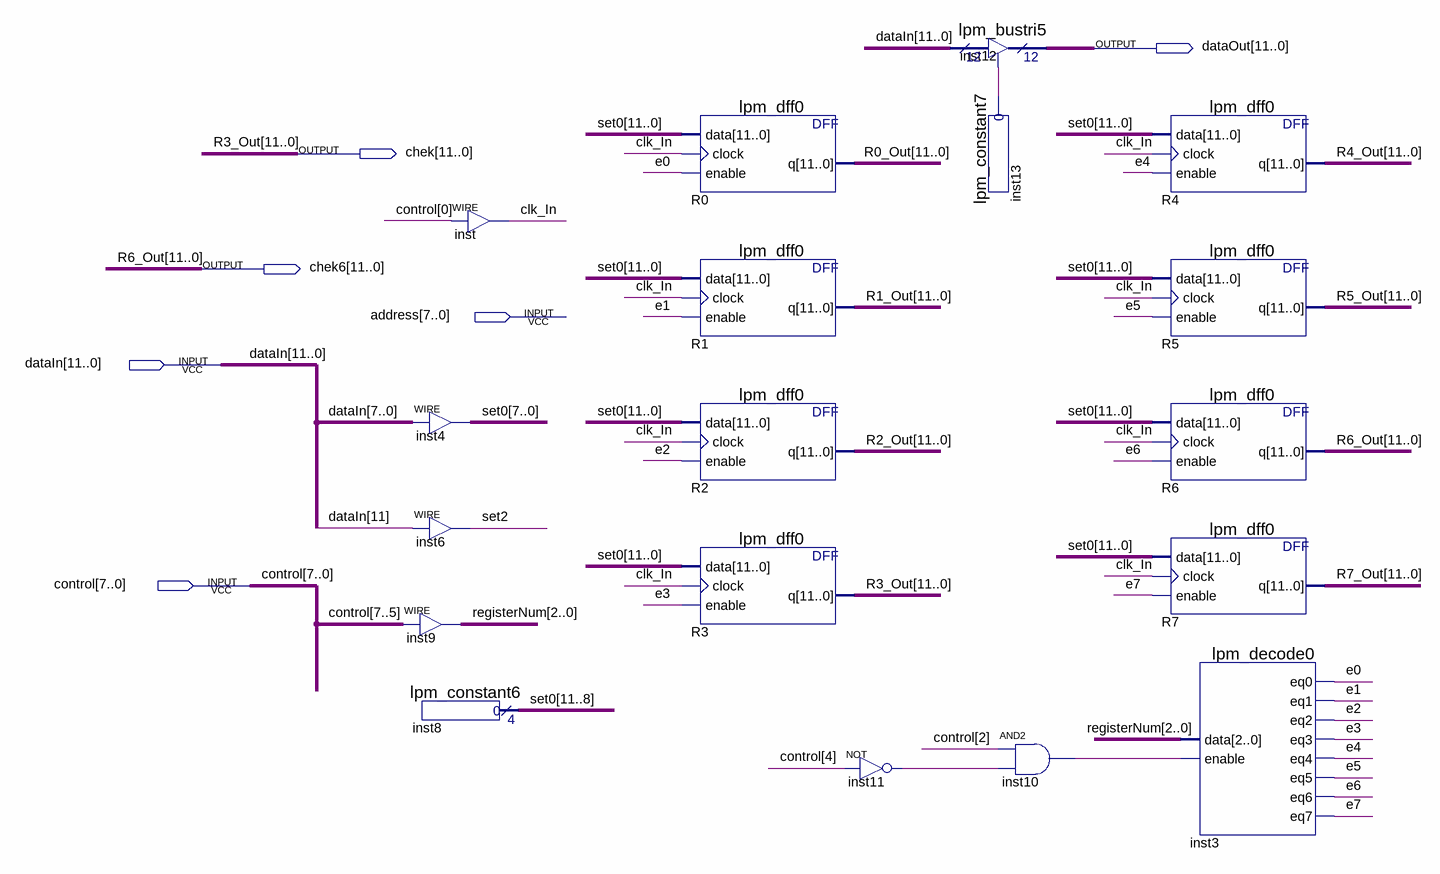
[diagram p0: schematic sheet]
// Quartus schematic Registers.bdf as structural Verilog: 18 symbols, 6 pins
module Registers (
  input  [7:0] address,
  input  [11:0] dataIn,
  input  [7:0] control,
  output [11:0] dataOut,
  output [11:0] chek,
  output [11:0] chek6
);

  wire clk_In, e0, e1, e2, e3, e4, e5, e6, e7, inst10_out, inst11_out, inst13_result, set2;
  wire [2:0] registerNum;
  wire [11:0] R0_Out, R1_Out, R2_Out, R4_Out, R5_Out, R7_Out, set0;

  assign registerNum = control[7:5];  // WIRE inst9
  lpm_constant6 inst8 (.result(set0[11:8]));
  assign clk_In = control[0];  // WIRE inst
  assign set0[7:0] = dataIn[7:0];  // WIRE inst4
  assign set2 = dataIn[11];  // WIRE inst6
  lpm_dff0 R0 (.data(set0), .clock(clk_In), .enable(e0), .q(R0_Out));
  lpm_dff0 R1 (.data(set0), .clock(clk_In), .enable(e1), .q(R1_Out));
  lpm_dff0 R2 (.data(set0), .clock(clk_In), .enable(e2), .q(R2_Out));
  lpm_dff0 R3 (.data(set0), .clock(clk_In), .enable(e3), .q(chek));
  not inst11 (inst11_out, control[4]);
  lpm_bustri5 inst12 (.enabledt(inst13_result), .data(dataIn), .tridata(dataOut));
  lpm_constant7 inst13 (.result(inst13_result));
  and inst10 (inst10_out, control[2], inst11_out);
  lpm_dff0 R4 (.data(set0), .clock(clk_In), .enable(e4), .q(R4_Out));
  lpm_dff0 R5 (.data(set0), .clock(clk_In), .enable(e5), .q(R5_Out));
  lpm_dff0 R6 (.data(set0), .clock(clk_In), .enable(e6), .q(chek6));
  lpm_dff0 R7 (.data(set0), .clock(clk_In), .enable(e7), .q(R7_Out));
  lpm_decode0 inst3 (
    .data(registerNum), .enable(inst10_out), .eq0(e0), .eq1(e1), .eq2(e2), .eq3(e3), .eq4(e4), .eq5(e5),
    .eq6(e6), .eq7(e7));

  // Other names for the same wires on the sheet: R3_Out[11:0] = chek; R6_Out[11:0] = chek6
endmodule
